# EAGLE schematic timer v2 (EAGLE 9.7.0)
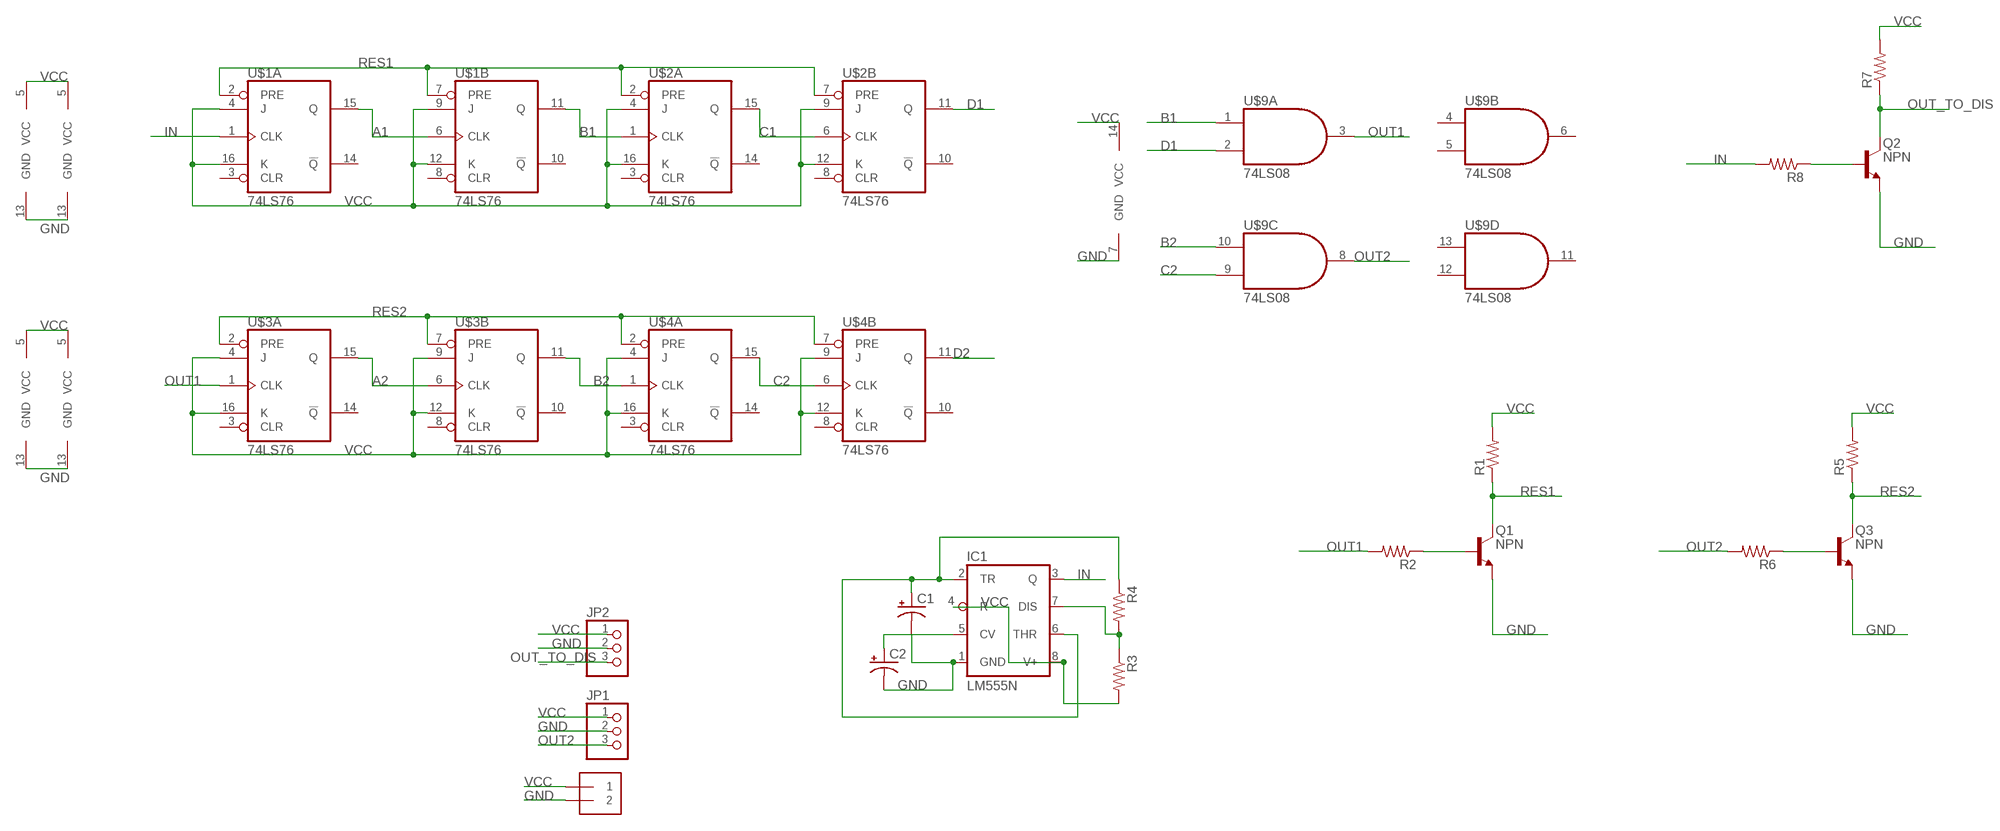
[diagram p0: schematic, sheet 1]

## Parts
C1  C-POL-US_RADIAL-20MM-DIA  [CAPPRD550W60D1200H2000B]
C2  C-POL-US_RADIAL-20MM-DIA  [CAPPRD550W60D1200H2000B]
IC1  LM555N  [DIL08-ROUND]
J1  1X2-3.5MM  [1X2-3.5MM]
JP1  PINHD-1X3CB  [1X03-CLEANBIG]
JP2  PINHD-1X3CB  [1X03-CLEANBIG]
Q1  NPN  NPN_TO92-EBC  [TO92]
Q2  NPN  NPN_TO92-EBC  [TO92]
Q3  NPN  NPN_TO92-EBC  [TO92]
R1  R-US_AXIAL-7.2MM-PITCH  [RESAD724W46L381D178B]
R2  R-US_AXIAL-7.2MM-PITCH  [RESAD724W46L381D178B]
R3  R-US_AXIAL-7.2MM-PITCH  [RESAD724W46L381D178B]
R4  R-US_AXIAL-7.2MM-PITCH  [RESAD724W46L381D178B]
R5  R-US_AXIAL-7.2MM-PITCH  [RESAD724W46L381D178B]
R6  R-US_AXIAL-7.2MM-PITCH  [RESAD724W46L381D178B]
R7  R-US_AXIAL-7.2MM-PITCH  [RESAD724W46L381D178B]
R8  R-US_AXIAL-7.2MM-PITCH  [RESAD724W46L381D178B]
U$1  74LS76  [DIO16]
U$2  74LS76  [DIO16]
U$3  74LS76  [DIO16]
U$4  74LS76  [DIO16]
U$9  74LS08  [DIO14]

## Nets
A1: U$1.6(B:CLK) U$1.15(A:Q)
A2: U$3.6(B:CLK) U$3.15(A:Q)
B1: U$1.11(B:Q) U$2.1(A:CLK) U$9.1(A:I0)
B2: U$3.11(B:Q) U$4.1(A:CLK) U$9.10(C:I0)
C1: U$2.6(B:CLK) U$2.15(A:Q)
C2: U$4.6(B:CLK) U$4.15(A:Q) U$9.9(C:I1)
D1: U$2.11(B:Q) U$9.2(A:I1)
D2: U$4.11(B:Q)
GND: C1.2(-) C2.2(-) IC1.1(GND) J1.2 JP1.2 JP2.2 Q1.1(E) Q2.1(E) Q3.1(E) U$1.13(GND) U$2.13(GND) U$3.13(GND) U$4.13(GND) U$9.7(GND)
IN: IC1.3(Q) R8.2 U$1.1(A:CLK)
N$2: IC1.7(DIS) R3.1 R4.2
N$3: C1.1(+) IC1.2(TR) IC1.6(THR) R4.1
N$5: C2.1(+) IC1.5(CV)
N$6: Q2.2(B) R8.1
N$11: Q3.2(B) R6.1
N$16: Q1.2(B) R2.1
OUT1: R2.2 U$3.1(A:CLK) U$9.3(A:O)
OUT2: JP1.3 R6.2 U$9.8(C:O)
OUT_TO_DIS: JP2.3 Q2.3(C) R7.1
RES1: Q1.3(C) R1.1 U$1.2(A:PRE) U$1.7(B:PRE) U$2.2(A:PRE) U$2.7(B:PRE)
RES2: Q3.3(C) R5.1 U$3.2(A:PRE) U$3.7(B:PRE) U$4.2(A:PRE) U$4.7(B:PRE)
VCC: IC1.4(R) IC1.8(V+) J1.1 JP1.1 JP2.1 R1.2 R3.2 R5.2 R7.2 U$1.4(A:J) U$1.5(VCC) U$1.9(B:J) U$1.12(B:K) U$1.16(A:K) U$2.4(A:J) U$2.5(VCC) U$2.9(B:J) U$2.12(B:K) U$2.16(A:K) U$3.4(A:J) U$3.5(VCC) U$3.9(B:J) U$3.12(B:K) U$3.16(A:K) U$4.4(A:J) U$4.5(VCC) U$4.9(B:J) U$4.12(B:K) U$4.16(A:K) U$9.14(VCC)
Unconnected: U$1.3(A:CLR) U$1.8(B:CLR) U$1.10(B:!Q) U$1.14(A:!Q) U$2.3(A:CLR) U$2.8(B:CLR) U$2.10(B:!Q) U$2.14(A:!Q) U$3.3(A:CLR) U$3.8(B:CLR) U$3.10(B:!Q) U$3.14(A:!Q) U$4.3(A:CLR) U$4.8(B:CLR) U$4.10(B:!Q) U$4.14(A:!Q) U$9.4(B:I0) U$9.5(B:I1) U$9.6(B:O) U$9.11(D:O) U$9.12(D:I1) U$9.13(D:I0)

## Library data of the parts
C1 C2 = Capacitor:C-POL-US: Capacitor Polarised - ANSI; CATEGORY: Capacitor
IC1 = adafruit:*555: TIMER Changed DIP package to have round (not oval) pin pads http://www.ladyada.net/library/pcb/eaglelibrary.html
J1 = adafruit:1X2: 3.5mm Terminal block http://www.ladyada.net/library/pcb/eaglelibrary.html
JP1 JP2 = adafruit:PINHD-1X3: PIN HEADER
Q1-Q3 = Transistor:NPN: NPN - Generic; CATEGORY: Transistor; SUB-CATEGORY: BJT; TYPE: NPN
R1-R8 = Tutorial - Fusion 360:R-US: Resistor Fixed - ANSI; CATEGORY: Resistor; SUB-CATEGORY: Fixed
U$1-U$4 = Library:74LS76
U$9 = Library:74LS08